# Altium schematic sheet hazir_moduller.SchDoc
size A
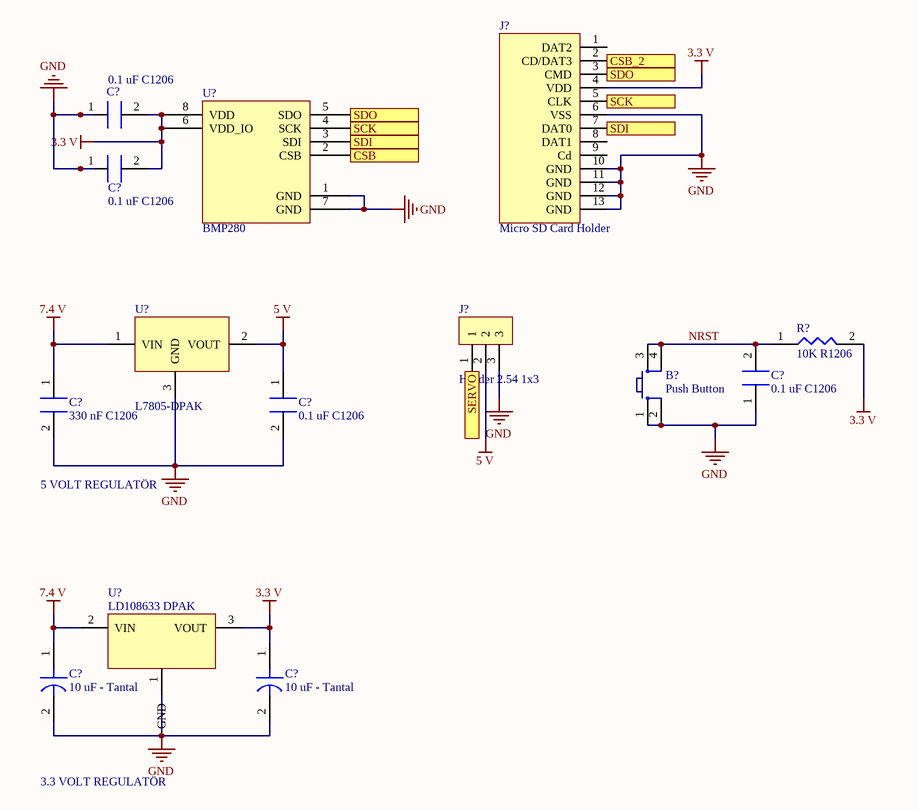
[diagram p0: hazir_moduller.SchDoc]

## Parts
(Parts that share a designator on the sheet are numbered #1, #2 ... from top to bottom, then left to right.)
B?  Push Button  [PUSB BUTTON-SMD]
C?#1  0.1 uF C1206  [C1206]
C?#2  0.1 uF C1206  [C1206]
C?#3  330 nF C1206  [C1206]
C?#4  0.1 uF C1206  [C1206]
C?#5  0.1 uF C1206  [C1206]
C?#6  10 uF - Tantal  [C1206- TANTAL]
C?#7  10 uF - Tantal  [C1206- TANTAL]
J?#1  Micro SD Card Holder  [Micro SD Card Holder]
J?#2  Header 2.54 1x3  [Header 2.54 1x3]
R?  10K R1206  [R1206 Resıstor]
U?#1  BMP280  [BMP280]
U?#2  L7805-DPAK  [DPAK228P972X230-3N]
U?#3  LD108633 DPAK  [DPAK228P972X230-3N]

## Ports
CSB, CSB_2, SCK, SDI, SDO, SERVO

## Nets
3.3 V: C?#1.2 C?#2.2 C?#7.1 J?#1.4(VDD) R?.2 U?#1.6(VDD_IO) U?#1.8(VDD) U?#3.3(VOUT)
5 V: C?#4.1 J?#2.2 U?#2.2(VOUT)
7.4 V: C?#3.1 C?#6.1 U?#2.1(VIN) U?#3.2(VIN)
GND: B?.1 B?.2 C?#1.1 C?#2.1 C?#3.2 C?#4.2 C?#5.1 C?#6.2 C?#7.2 J?#1.6(VSS) J?#1.10(GND) J?#1.11(GND) J?#1.12(GND) J?#1.13(GND) J?#2.3 U?#1.1(GND) U?#1.7(GND) U?#2.3(GND)
CSB: U?#1.2(CSB) ; port CSB
CSB_2: J?#1.2(CD/DAT3) ; port CSB_2
NRST: B?.3 B?.4 C?#5.2 R?.1
SCK: J?#1.5(CLK) U?#1.4(SCK) ; port SCK
SDI: J?#1.7(DAT0) U?#1.3(SDI) ; port SDI
SDO: J?#1.3(CMD) U?#1.5(SDO) ; port SDO
SERVO: J?#2.1 ; port SERVO

Not connected (* = marked no-connect by the designer): J?#1 1(DAT2) 8(DAT1) 9(Cd); U?#3 1(GND)

## Notes on the sheet
- 5 VOLT REGULATÖR
- 3.3 VOLT REGULATÖR

## Library data of the parts
B? = Push Button: Smd Push Button; Satın Alma Linki: https://urun.n11.com/diger/mini-pushbutton-switch-smd-P227461537?gclid=Cj0KCQjwkoDmBRCcARIsAG3xzl8Y_-jeD7HocNM6lvuZ_rVp83568XPGtNzlPwXWLph8oCRqo0yh87UaApZYEALw_wcB&gclsrc=aw.ds
U?#2 = L7805-DPAK: L7805 5V REGULATOR. SMD PAKET
U?#3 = LD108633 DPAK: LD1086 3.3V REGULATOR